# EAGLE design adapter (EAGLE 9.5.1)
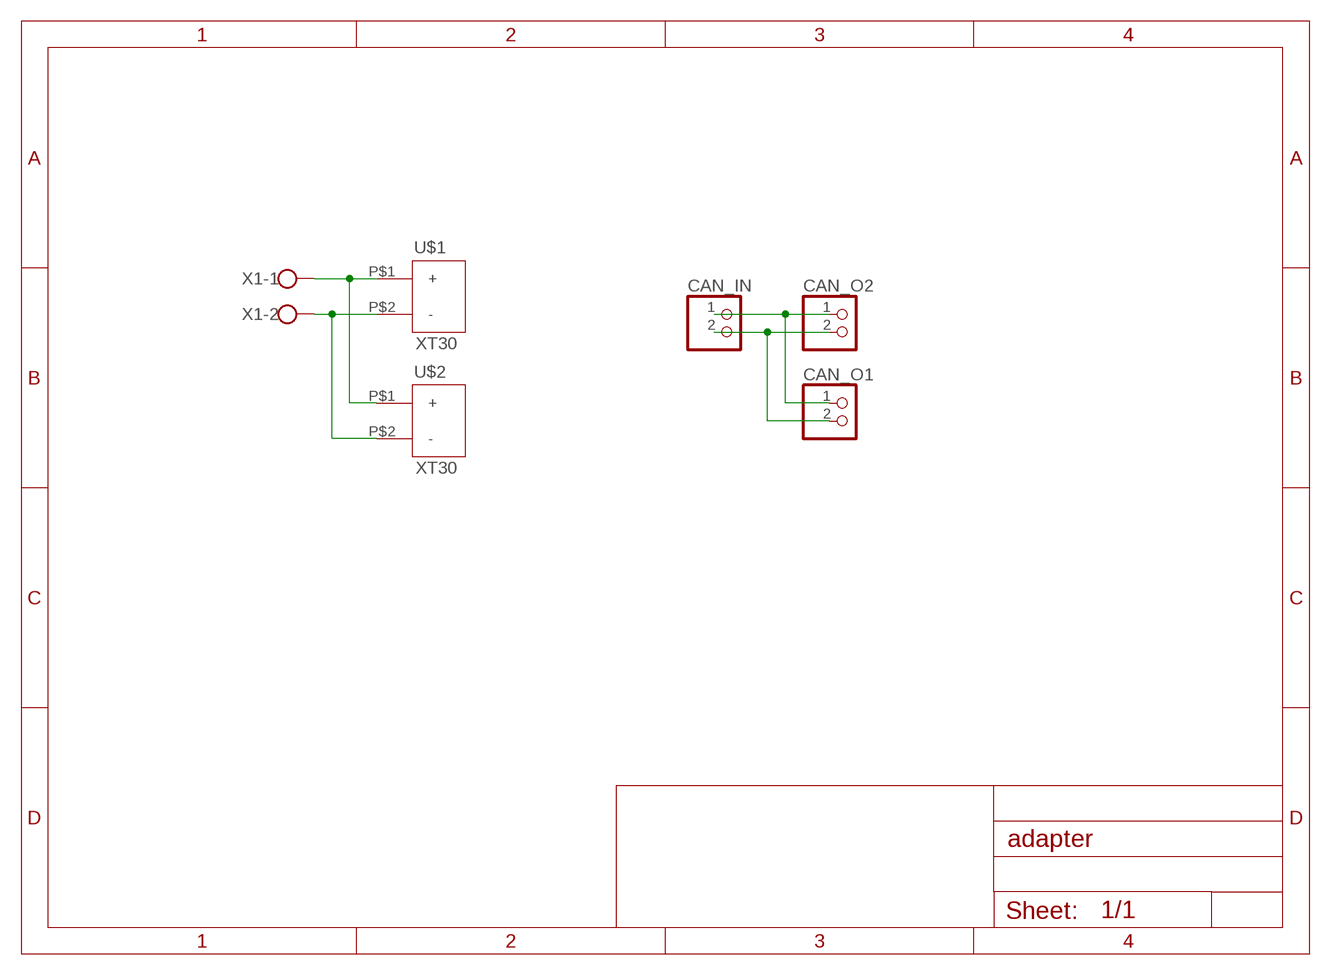
[diagram p0: schematic, sheet 1]

## Parts
CAN_IN  PINHD-1X2  [1X02]
CAN_O1  PINHD-1X2  [1X02]
CAN_O2  PINHD-1X2  [1X02]
U$1  XT30  [XT30U-F]
U$2  XT30  [XT30U-F]
X1  W237-102  [W237-102]

## Nets
N$1: U$1.P$1(+) U$2.P$1(+) X1.1
N$2: U$1.P$2(-) U$2.P$2(-) X1.2
N$3: CAN_IN.1 CAN_O1.1 CAN_O2.1
N$4: CAN_IN.2 CAN_O1.2 CAN_O2.2

## Library data of the parts
CAN_IN CAN_O1 CAN_O2 = pinhead:PINHD-1X2: PIN HEADER
U$1 U$2 = NikodemBartnik:XT30: XT30 Power connector
X1 = con-wago-500:W237-102: WAGO SCREW CLAMP; MPN: 237-102; OC_FARNELL: unknown; OC_NEWARK: 70K9898

## Board
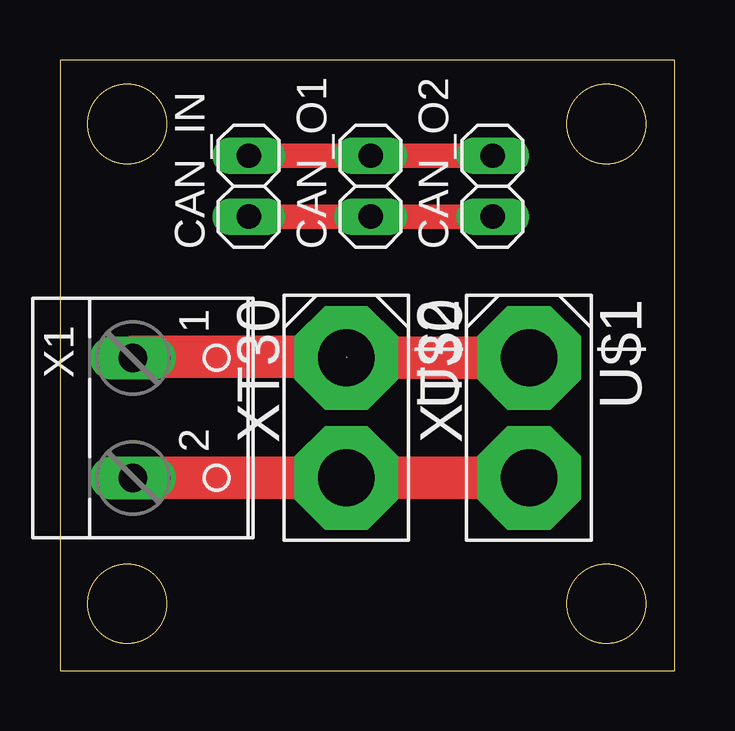
[diagram p1: board, top side]

Size 25.63 x 25.45 mm. Coordinates in mm from the lower left corner, seen from the top.
Outline: 0,0 25.63,0 25.63,25.45 0,25.45 0,0
Outline: circle at 2.79,2.79 radius 1.65
Outline: circle at 2.79,22.78 radius 1.65
Outline: circle at 22.78,2.79 radius 1.65
Outline: circle at 22.78,22.78 radius 1.65
Copper layers (1*16): Top 0.035mm / dielectric 1.5mm / Bottom 0.035mm
Design rules "default": minimum track width 6mil, minimum drill 0.35mm, track to track 6mil, track to pad 6mil, pad to pad 6mil, via to via 6mil, smd to smd 6mil, copper to edge 40mil, drill to drill 6mil, minimum pad ring 10mil, minimum via ring 8mil, stop-mask expansion 4mil, vias tented up to drill 0mil, thermal gap 10mil

### Footprints (pad centres in the part's own frame; a part is rotated, then mirrored left to right if it is on the bottom)
1X02 = drill 1.016 long: 1 -1.27,0; 2 1.27,0
XT30U-F = drill 2.362 pad 4.318 octagon: P$1 -2.5,0; P$2 2.5,0
W237-102 = drill 1.194 long: 1 -2.5,-1.27; 2 2.5,-1.27

### Placement (x,y rotation side)
CAN_IN  7.87,20.19 90 top
CAN_O1  12.95,20.19 90 top
CAN_O2  18.03,20.19 90 top
U$1  19.56,10.54 270 top
U$2  11.94,10.54 270 top
X1  4.32,10.54 270 top

### Tracks (layer width: path | path; a pad name or v marks a point on that pad's centre or on a via)
N$1  (1 unrouted)
  Top 1.778: X1.1 3.09,13.08 11.94,13.08 | U$2.P$1 U$1.P$1
N$2
  Top 1.778: X1.2 U$2.P$2 U$1.P$2
N$3
  Top 1.016: CAN_IN.1 CAN_O1.1 CAN_O2.1
N$4
  Top 1.016: CAN_IN.2 CAN_O1.2 CAN_O2.2